# EAGLE schematic NeoPixelClock (EAGLE 8.7.1)
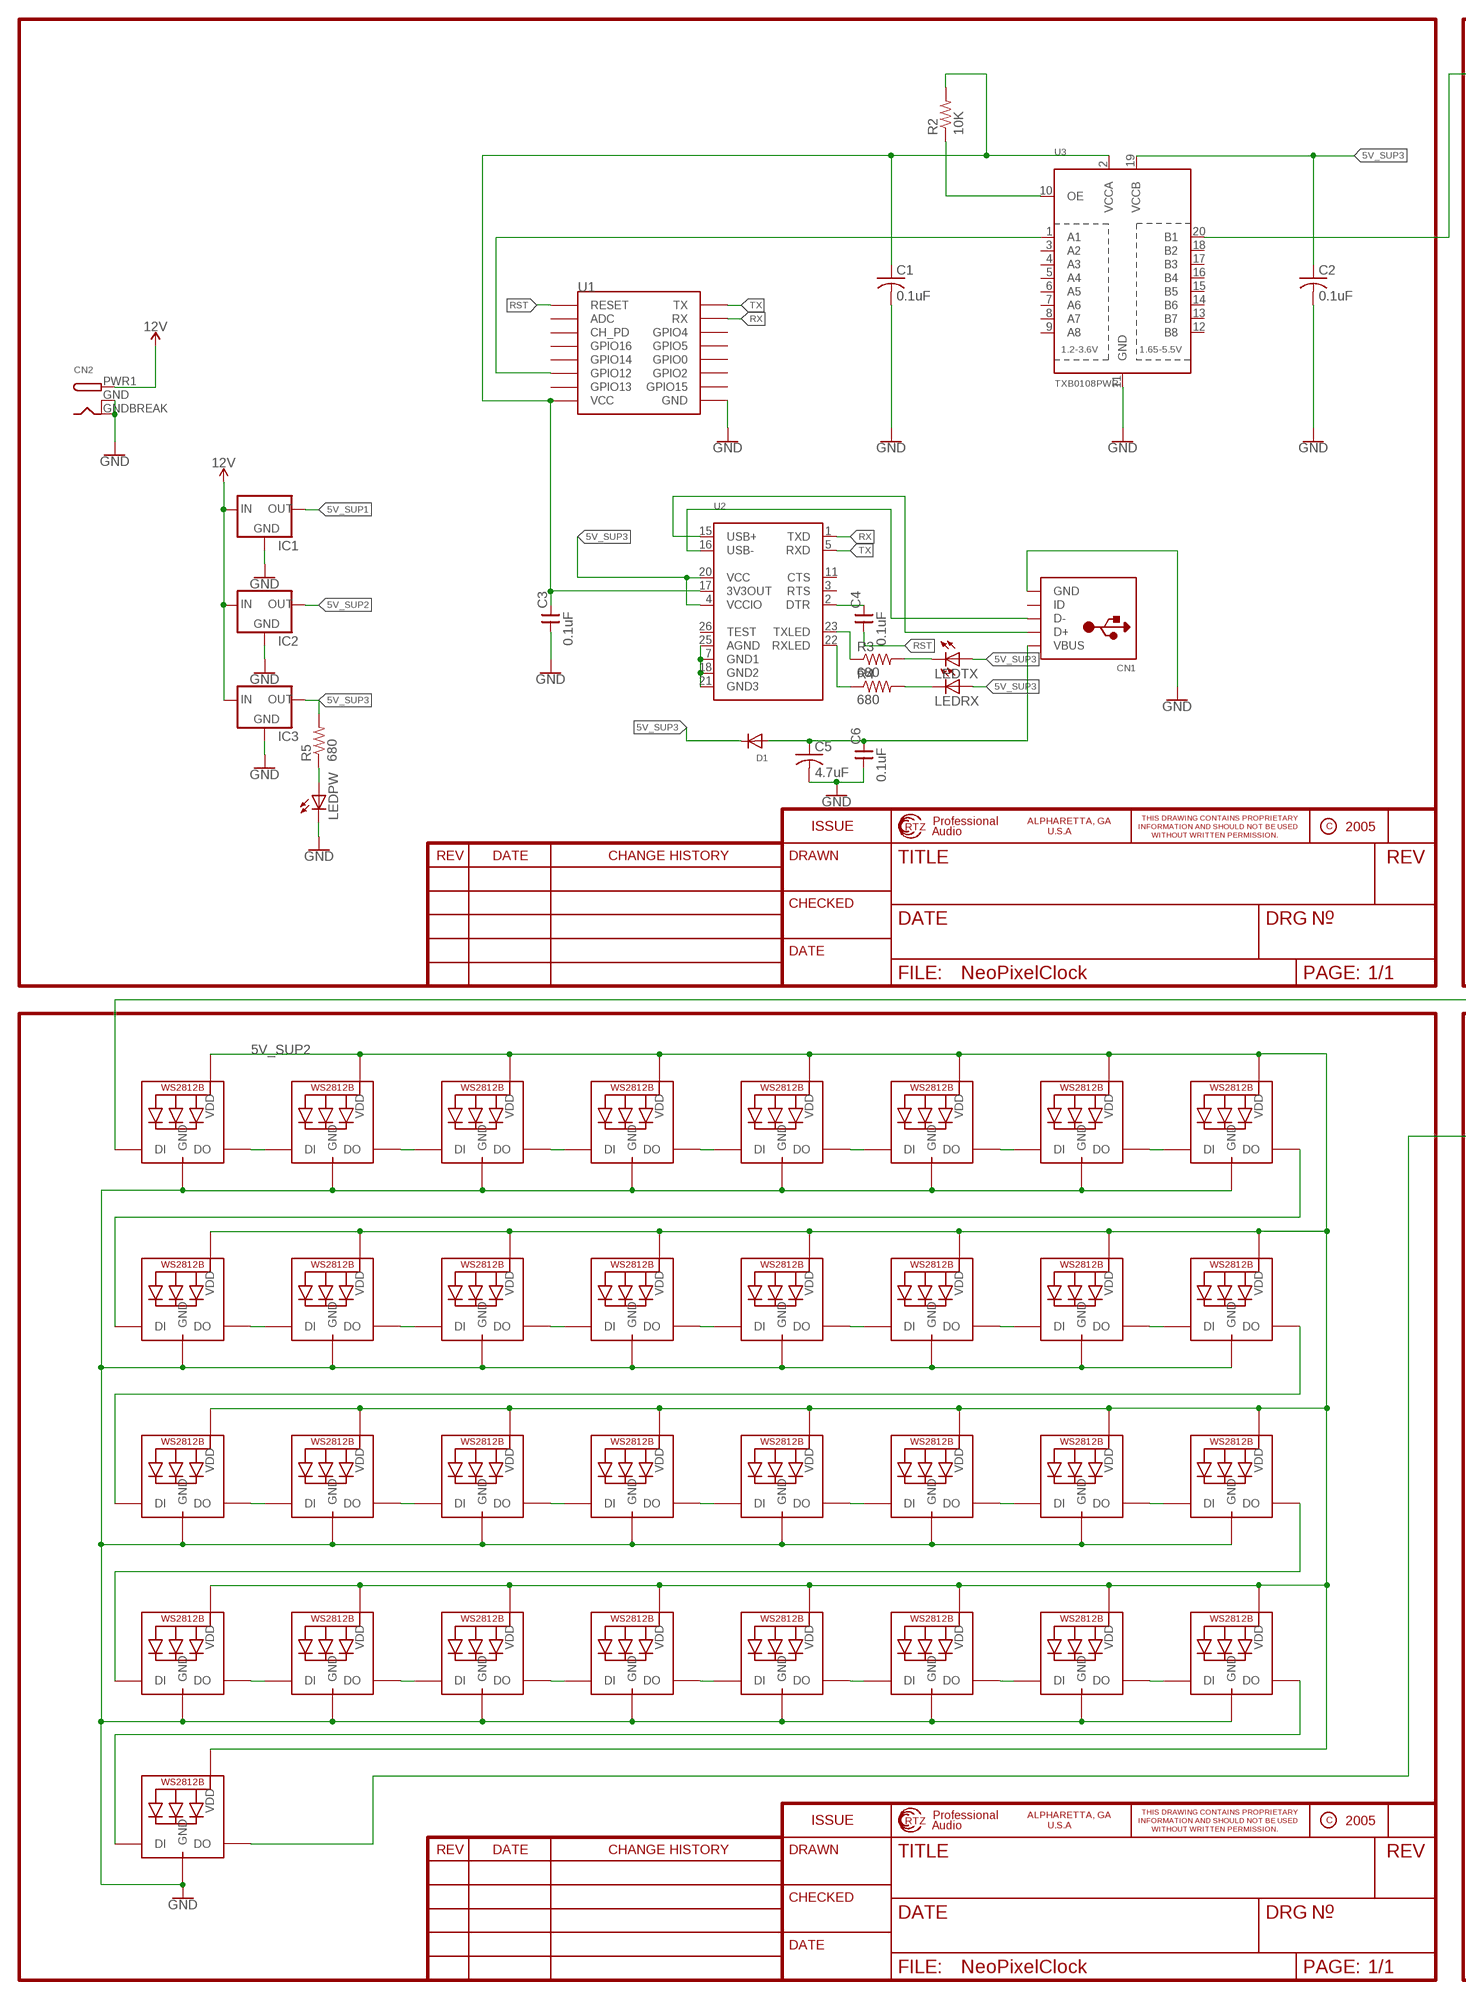
[diagram p0: schematic, sheet 1, part 1 of 2]
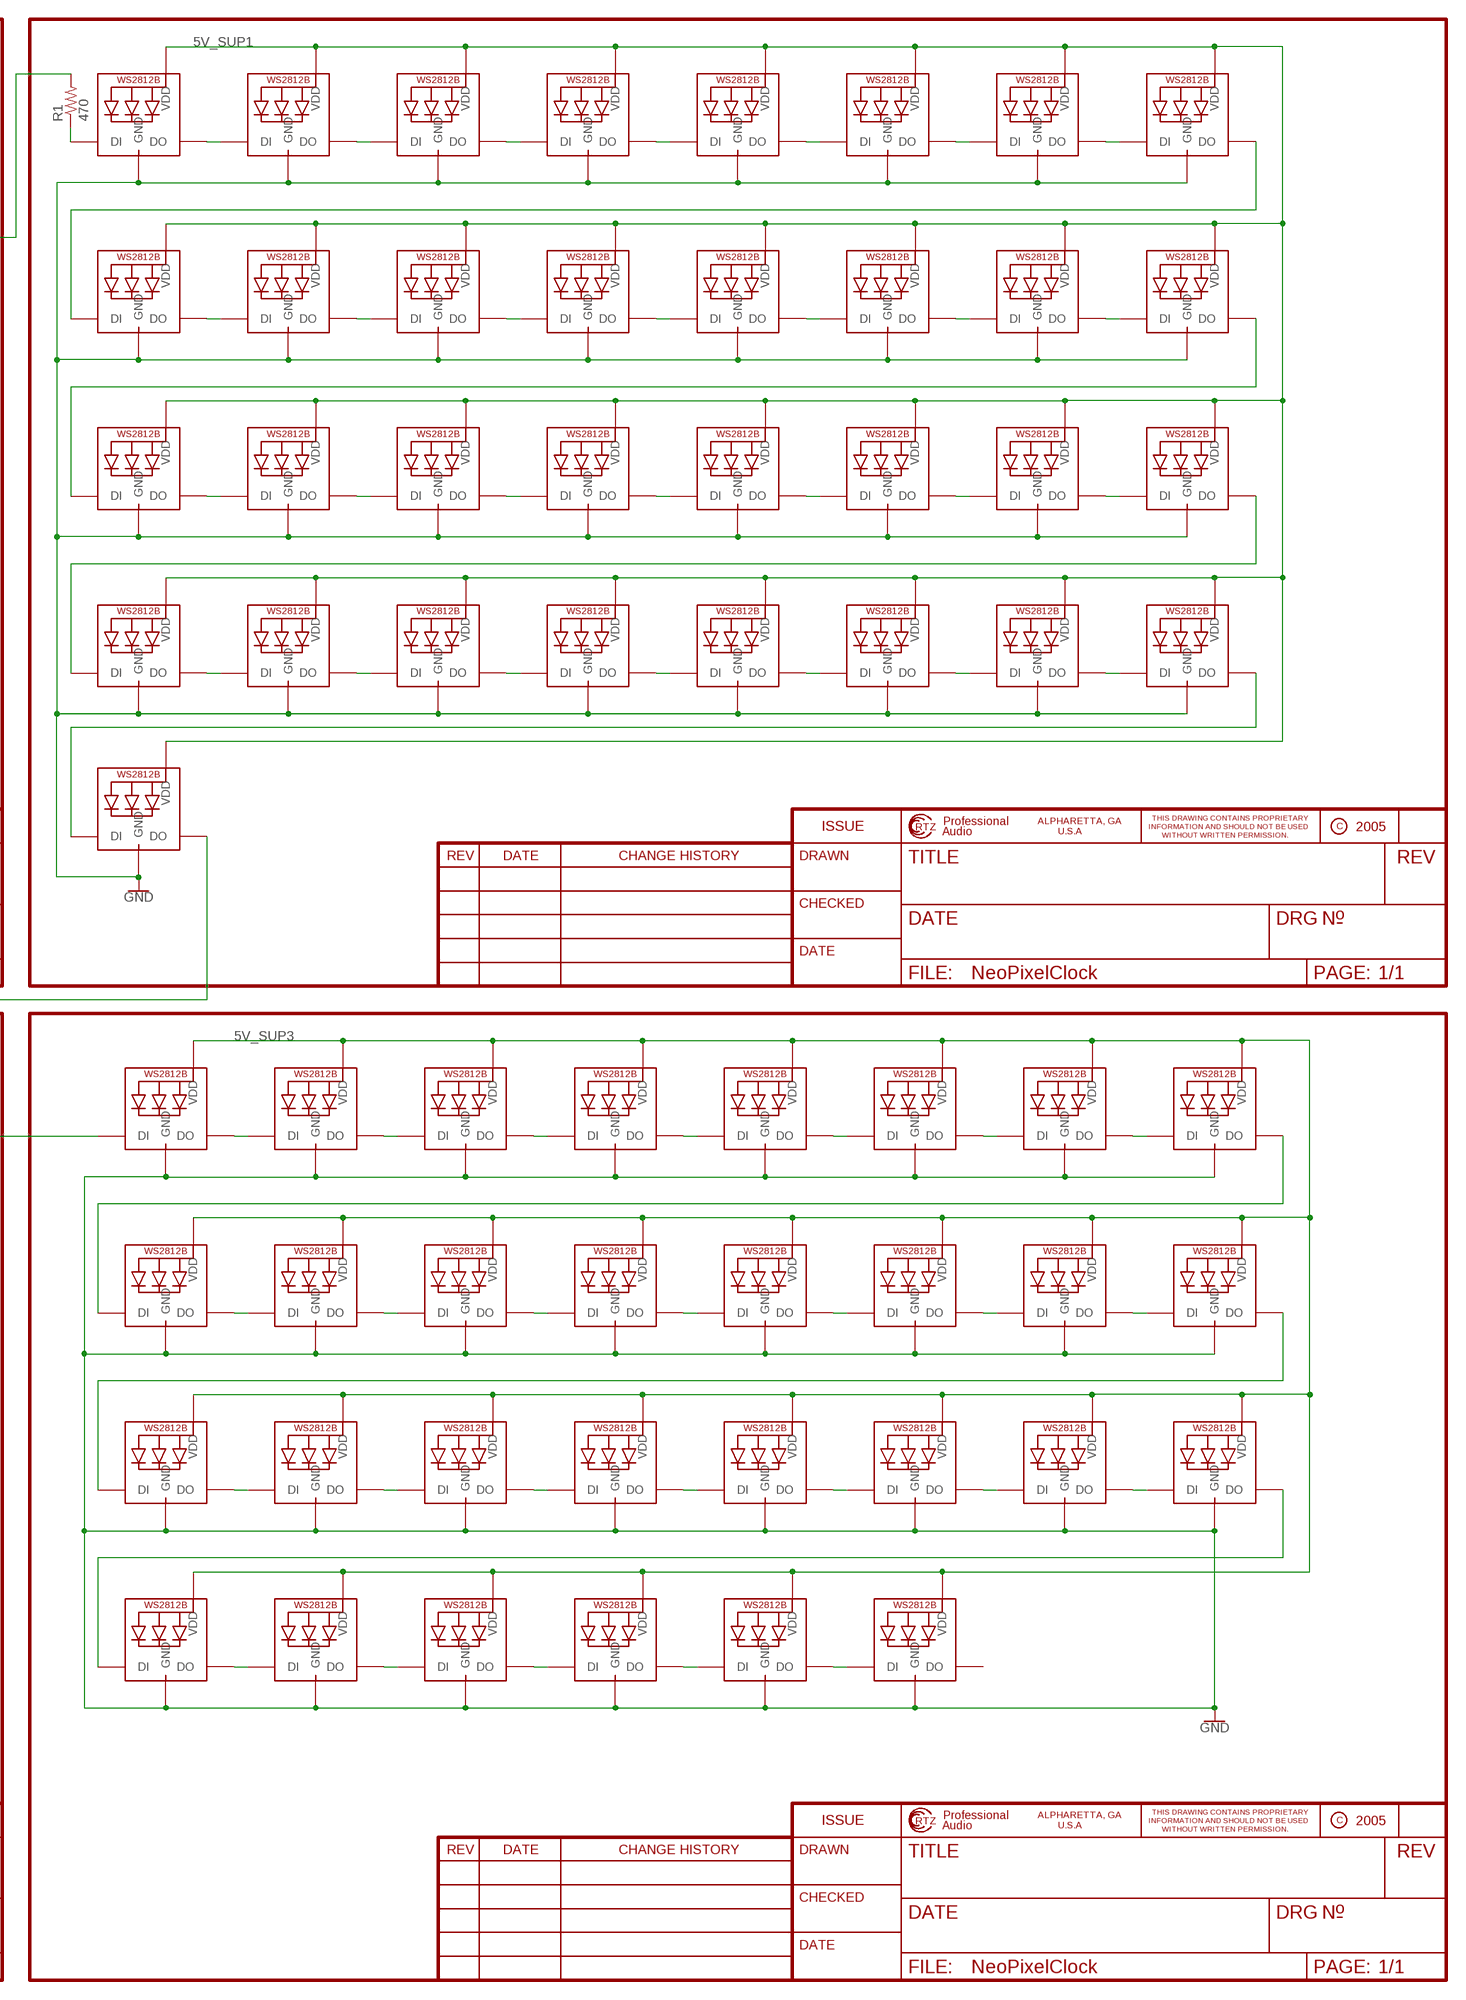
[diagram p1: schematic, sheet 1, part 2 of 2]

## Parts
C1  0.1uF  C-USC0805  [C0805]
C2  0.1uF  C-USC0805  [C0805]
C3  0.1uF  CNP-0805  [0805]
C4  0.1uF  CNP-0805  [0805]
C5  4.7uF  C-USC0805  [C0805]
C6  0.1uF  CNP-0805  [0805]
CN1  USBMINIB  [USB-MINIB]
CN2  DCBARRELSMT  [DCJACK_2MM_SMT]
D1  DIODESOD-123  [SOD-123]
IC1  V_REG_78XXSIDE  [78XXL]
IC2  V_REG_78XXSIDE  [78XXL]
IC3  V_REG_78XXSIDE  [78XXL]
LED1  WS2812B5050  [WS2812B]
LED2  WS2812B5050  [WS2812B]
LED3  WS2812B5050  [WS2812B]
LED4  WS2812B5050  [WS2812B]
LED5  WS2812B5050  [WS2812B]
LED6  WS2812B5050  [WS2812B]
LED7  WS2812B5050  [WS2812B]
LED8  WS2812B5050  [WS2812B]
LED9  WS2812B5050  [WS2812B]
LED10  WS2812B5050  [WS2812B]
LED11  WS2812B5050  [WS2812B]
LED12  WS2812B5050  [WS2812B]
LED13  WS2812B5050  [WS2812B]
LED14  WS2812B5050  [WS2812B]
LED15  WS2812B5050  [WS2812B]
LED16  WS2812B5050  [WS2812B]
LED17  WS2812B5050  [WS2812B]
LED18  WS2812B5050  [WS2812B]
LED19  WS2812B5050  [WS2812B]
LED20  WS2812B5050  [WS2812B]
LED21  WS2812B5050  [WS2812B]
LED22  WS2812B5050  [WS2812B]
LED23  WS2812B5050  [WS2812B]
LED24  WS2812B5050  [WS2812B]
LED25  WS2812B5050  [WS2812B]
LED26  WS2812B5050  [WS2812B]
LED27  WS2812B5050  [WS2812B]
LED28  WS2812B5050  [WS2812B]
LED29  WS2812B5050  [WS2812B]
LED30  WS2812B5050  [WS2812B]
LED31  WS2812B5050  [WS2812B]
LED32  WS2812B5050  [WS2812B]
LED33  WS2812B5050  [WS2812B]
LED34  WS2812B5050  [WS2812B]
LED35  WS2812B5050  [WS2812B]
LED36  WS2812B5050  [WS2812B]
LED37  WS2812B5050  [WS2812B]
LED38  WS2812B5050  [WS2812B]
LED39  WS2812B5050  [WS2812B]
LED40  WS2812B5050  [WS2812B]
LED41  WS2812B5050  [WS2812B]
LED42  WS2812B5050  [WS2812B]
LED43  WS2812B5050  [WS2812B]
LED44  WS2812B5050  [WS2812B]
LED45  WS2812B5050  [WS2812B]
LED46  WS2812B5050  [WS2812B]
LED47  WS2812B5050  [WS2812B]
LED48  WS2812B5050  [WS2812B]
LED49  WS2812B5050  [WS2812B]
LED50  WS2812B5050  [WS2812B]
LED51  WS2812B5050  [WS2812B]
LED52  WS2812B5050  [WS2812B]
LED53  WS2812B5050  [WS2812B]
LED54  WS2812B5050  [WS2812B]
LED55  WS2812B5050  [WS2812B]
LED56  WS2812B5050  [WS2812B]
LED57  WS2812B5050  [WS2812B]
LED58  WS2812B5050  [WS2812B]
LED59  WS2812B5050  [WS2812B]
LED60  WS2812B5050  [WS2812B]
LED61  WS2812B5050  [WS2812B]
LED62  WS2812B5050  [WS2812B]
LED63  WS2812B5050  [WS2812B]
LED64  WS2812B5050  [WS2812B]
LED65  WS2812B5050  [WS2812B]
LED66  WS2812B5050  [WS2812B]
LED67  WS2812B5050  [WS2812B]
LED68  WS2812B5050  [WS2812B]
LED69  WS2812B5050  [WS2812B]
LED70  WS2812B5050  [WS2812B]
LED71  WS2812B5050  [WS2812B]
LED72  WS2812B5050  [WS2812B]
LED73  WS2812B5050  [WS2812B]
LED74  WS2812B5050  [WS2812B]
LED75  WS2812B5050  [WS2812B]
LED76  WS2812B5050  [WS2812B]
LED77  WS2812B5050  [WS2812B]
LED78  WS2812B5050  [WS2812B]
LED79  WS2812B5050  [WS2812B]
LED80  WS2812B5050  [WS2812B]
LED81  WS2812B5050  [WS2812B]
LED82  WS2812B5050  [WS2812B]
LED83  WS2812B5050  [WS2812B]
LED84  WS2812B5050  [WS2812B]
LED85  WS2812B5050  [WS2812B]
LED86  WS2812B5050  [WS2812B]
LED87  WS2812B5050  [WS2812B]
LED88  WS2812B5050  [WS2812B]
LED89  WS2812B5050  [WS2812B]
LED90  WS2812B5050  [WS2812B]
LED91  WS2812B5050  [WS2812B]
LED92  WS2812B5050  [WS2812B]
LED93  WS2812B5050  [WS2812B]
LED94  WS2812B5050  [WS2812B]
LED95  WS2812B5050  [WS2812B]
LED96  WS2812B5050  [WS2812B]
LEDPW  LEDCHIP-LED0805  [CHIP-LED0805]
LEDRX  LEDCHIP-LED0805  [CHIP-LED0805]
LEDTX  LEDCHIP-LED0805  [CHIP-LED0805]
R1  470  R-US_M0805  [M0805]
R2  10K  R-US_R0805  [R0805]
R3  680  R-US_R0805  [R0805]
R4  680  R-US_R0805  [R0805]
R5  680  R-US_R0805  [R0805]
U1  ESP12  [ESP12]
U2  FT232RLSSOP28  [SSOP28DB]
U3  TXB0108PWR  [TSSOP20]

## Nets
3V3: C1.1 C3.2 R2.2 U1.VCC U2.17(3V3OUT) U3.2(VCCA)
5V_SUP1: IC1.OUT LED1.1-VDD(VDD) LED2.1-VDD(VDD) LED3.1-VDD(VDD) LED4.1-VDD(VDD) LED5.1-VDD(VDD) LED6.1-VDD(VDD) LED7.1-VDD(VDD) LED8.1-VDD(VDD) LED9.1-VDD(VDD) LED10.1-VDD(VDD) LED11.1-VDD(VDD) LED12.1-VDD(VDD) LED13.1-VDD(VDD) LED14.1-VDD(VDD) LED15.1-VDD(VDD) LED16.1-VDD(VDD) LED17.1-VDD(VDD) LED18.1-VDD(VDD) LED19.1-VDD(VDD) LED20.1-VDD(VDD) LED21.1-VDD(VDD) LED22.1-VDD(VDD) LED23.1-VDD(VDD) LED24.1-VDD(VDD) LED25.1-VDD(VDD) LED26.1-VDD(VDD) LED27.1-VDD(VDD) LED28.1-VDD(VDD) LED29.1-VDD(VDD) LED30.1-VDD(VDD) LED31.1-VDD(VDD) LED32.1-VDD(VDD) LED33.1-VDD(VDD)
5V_SUP2: IC2.OUT LED34.1-VDD(VDD) LED35.1-VDD(VDD) LED36.1-VDD(VDD) LED37.1-VDD(VDD) LED38.1-VDD(VDD) LED39.1-VDD(VDD) LED40.1-VDD(VDD) LED41.1-VDD(VDD) LED42.1-VDD(VDD) LED43.1-VDD(VDD) LED44.1-VDD(VDD) LED45.1-VDD(VDD) LED46.1-VDD(VDD) LED47.1-VDD(VDD) LED48.1-VDD(VDD) LED49.1-VDD(VDD) LED50.1-VDD(VDD) LED51.1-VDD(VDD) LED52.1-VDD(VDD) LED53.1-VDD(VDD) LED54.1-VDD(VDD) LED55.1-VDD(VDD) LED56.1-VDD(VDD) LED57.1-VDD(VDD) LED58.1-VDD(VDD) LED59.1-VDD(VDD) LED60.1-VDD(VDD) LED61.1-VDD(VDD) LED62.1-VDD(VDD) LED63.1-VDD(VDD) LED64.1-VDD(VDD) LED65.1-VDD(VDD) LED66.1-VDD(VDD)
5V_SUP3: C2.1 D1.C IC3.OUT LED67.1-VDD(VDD) LED68.1-VDD(VDD) LED69.1-VDD(VDD) LED70.1-VDD(VDD) LED71.1-VDD(VDD) LED72.1-VDD(VDD) LED73.1-VDD(VDD) LED74.1-VDD(VDD) LED75.1-VDD(VDD) LED76.1-VDD(VDD) LED77.1-VDD(VDD) LED78.1-VDD(VDD) LED79.1-VDD(VDD) LED80.1-VDD(VDD) LED81.1-VDD(VDD) LED82.1-VDD(VDD) LED83.1-VDD(VDD) LED84.1-VDD(VDD) LED85.1-VDD(VDD) LED86.1-VDD(VDD) LED87.1-VDD(VDD) LED88.1-VDD(VDD) LED89.1-VDD(VDD) LED90.1-VDD(VDD) LED91.1-VDD(VDD) LED92.1-VDD(VDD) LED93.1-VDD(VDD) LED94.1-VDD(VDD) LED95.1-VDD(VDD) LED96.1-VDD(VDD) LEDRX.A LEDTX.A R5.2 U2.4(VCCIO) U2.20(VCC) U3.19(VCCB)
12V: CN2.PWR1(PWR) IC1.IN IC2.IN IC3.IN
GND: C1.2 C2.2 C3.1 C5.2 C6.1 CN1.GND CN2.GND(GNDBREAK) CN2.GNDBREAK(GND) IC1.GND IC2.GND IC3.GND LED1.3-GND(GND) LED2.3-GND(GND) LED3.3-GND(GND) LED4.3-GND(GND) LED5.3-GND(GND) LED6.3-GND(GND) LED7.3-GND(GND) LED8.3-GND(GND) LED9.3-GND(GND) LED10.3-GND(GND) LED11.3-GND(GND) LED12.3-GND(GND) LED13.3-GND(GND) LED14.3-GND(GND) LED15.3-GND(GND) LED16.3-GND(GND) LED17.3-GND(GND) LED18.3-GND(GND) LED19.3-GND(GND) LED20.3-GND(GND) LED21.3-GND(GND) LED22.3-GND(GND) LED23.3-GND(GND) LED24.3-GND(GND) LED25.3-GND(GND) LED26.3-GND(GND) LED27.3-GND(GND) LED28.3-GND(GND) LED29.3-GND(GND) LED30.3-GND(GND) LED31.3-GND(GND) LED32.3-GND(GND) LED33.3-GND(GND) LED34.3-GND(GND) LED35.3-GND(GND) LED36.3-GND(GND) LED37.3-GND(GND) LED38.3-GND(GND) LED39.3-GND(GND) LED40.3-GND(GND) LED41.3-GND(GND) LED42.3-GND(GND) LED43.3-GND(GND) LED44.3-GND(GND) LED45.3-GND(GND) LED46.3-GND(GND) LED47.3-GND(GND) LED48.3-GND(GND) LED49.3-GND(GND) LED50.3-GND(GND) LED51.3-GND(GND) LED52.3-GND(GND) LED53.3-GND(GND) LED54.3-GND(GND) LED55.3-GND(GND) LED56.3-GND(GND) LED57.3-GND(GND) LED58.3-GND(GND) LED59.3-GND(GND) LED60.3-GND(GND) LED61.3-GND(GND) LED62.3-GND(GND) LED63.3-GND(GND) LED64.3-GND(GND) LED65.3-GND(GND) LED66.3-GND(GND) LED67.3-GND(GND) LED68.3-GND(GND) LED69.3-GND(GND) LED70.3-GND(GND) LED71.3-GND(GND) LED72.3-GND(GND) LED73.3-GND(GND) LED74.3-GND(GND) LED75.3-GND(GND) LED76.3-GND(GND) LED77.3-GND(GND) LED78.3-GND(GND) LED79.3-GND(GND) LED80.3-GND(GND) LED81.3-GND(GND) LED82.3-GND(GND) LED83.3-GND(GND) LED84.3-GND(GND) LED85.3-GND(GND) LED86.3-GND(GND) LED87.3-GND(GND) LED88.3-GND(GND) LED89.3-GND(GND) LED90.3-GND(GND) LED91.3-GND(GND) LED92.3-GND(GND) LED93.3-GND(GND) LED94.3-GND(GND) LED95.3-GND(GND) LED96.3-GND(GND) LEDPW.C U1.GND U3.11(GND)
N$1: U1.GPIO12 U3.1(A1)
N$2: LED34.2-DOUT(DO) LED35.4-DIN(DI)
N$3: LED35.2-DOUT(DO) LED36.4-DIN(DI)
N$4: R1.2 U3.20(B1)
N$5: LED1.2-DOUT(DO) LED2.4-DIN(DI)
N$6: LED2.2-DOUT(DO) LED3.4-DIN(DI)
N$7: LED3.2-DOUT(DO) LED4.4-DIN(DI)
N$8: LED4.2-DOUT(DO) LED5.4-DIN(DI)
N$9: LED5.2-DOUT(DO) LED6.4-DIN(DI)
N$10: LED6.2-DOUT(DO) LED7.4-DIN(DI)
N$11: LED7.2-DOUT(DO) LED8.4-DIN(DI)
N$12: U2.7(GND1) U2.18(GND2) U2.21(GND3) U2.25(AGND)
N$13: LED8.2-DOUT(DO) LED9.4-DIN(DI)
N$14: LED9.2-DOUT(DO) LED10.4-DIN(DI)
N$15: LED10.2-DOUT(DO) LED11.4-DIN(DI)
N$16: LED11.2-DOUT(DO) LED12.4-DIN(DI)
N$17: LED12.2-DOUT(DO) LED13.4-DIN(DI)
N$18: LED13.2-DOUT(DO) LED14.4-DIN(DI)
N$19: LED14.2-DOUT(DO) LED15.4-DIN(DI)
N$20: LED15.2-DOUT(DO) LED16.4-DIN(DI)
N$22: LED16.2-DOUT(DO) LED17.4-DIN(DI)
N$23: LED17.2-DOUT(DO) LED18.4-DIN(DI)
N$24: LED18.2-DOUT(DO) LED19.4-DIN(DI)
N$25: LED19.2-DOUT(DO) LED20.4-DIN(DI)
N$26: LED20.2-DOUT(DO) LED21.4-DIN(DI)
N$27: LED21.2-DOUT(DO) LED22.4-DIN(DI)
N$28: LED22.2-DOUT(DO) LED23.4-DIN(DI)
N$29: LED23.2-DOUT(DO) LED24.4-DIN(DI)
N$31: LED24.2-DOUT(DO) LED25.4-DIN(DI)
N$32: LED25.2-DOUT(DO) LED26.4-DIN(DI)
N$33: LED26.2-DOUT(DO) LED27.4-DIN(DI)
N$34: LED27.2-DOUT(DO) LED28.4-DIN(DI)
N$35: LED28.2-DOUT(DO) LED29.4-DIN(DI)
N$36: LED29.2-DOUT(DO) LED30.4-DIN(DI)
N$37: LED30.2-DOUT(DO) LED31.4-DIN(DI)
N$38: LED31.2-DOUT(DO) LED32.4-DIN(DI)
N$40: LED32.2-DOUT(DO) LED33.4-DIN(DI)
N$41: LED36.2-DOUT(DO) LED37.4-DIN(DI)
N$42: LED37.2-DOUT(DO) LED38.4-DIN(DI)
N$43: LED38.2-DOUT(DO) LED39.4-DIN(DI)
N$44: LED39.2-DOUT(DO) LED40.4-DIN(DI)
N$45: LED40.2-DOUT(DO) LED41.4-DIN(DI)
N$46: C5.1 C6.2 CN1.VBUS D1.A
N$47: LED41.2-DOUT(DO) LED42.4-DIN(DI)
N$48: LED42.2-DOUT(DO) LED43.4-DIN(DI)
N$49: LED43.2-DOUT(DO) LED44.4-DIN(DI)
N$50: LED44.2-DOUT(DO) LED45.4-DIN(DI)
N$51: LED45.2-DOUT(DO) LED46.4-DIN(DI)
N$52: LED46.2-DOUT(DO) LED47.4-DIN(DI)
N$53: LED47.2-DOUT(DO) LED48.4-DIN(DI)
N$54: LED48.2-DOUT(DO) LED49.4-DIN(DI)
N$56: LED49.2-DOUT(DO) LED50.4-DIN(DI)
N$57: LED50.2-DOUT(DO) LED51.4-DIN(DI)
N$58: LED51.2-DOUT(DO) LED52.4-DIN(DI)
N$59: LED52.2-DOUT(DO) LED53.4-DIN(DI)
N$60: LED53.2-DOUT(DO) LED54.4-DIN(DI)
N$61: LED54.2-DOUT(DO) LED55.4-DIN(DI)
N$62: LED55.2-DOUT(DO) LED56.4-DIN(DI)
N$63: LED56.2-DOUT(DO) LED57.4-DIN(DI)
N$65: LED57.2-DOUT(DO) LED58.4-DIN(DI)
N$66: LED58.2-DOUT(DO) LED59.4-DIN(DI)
N$67: LED59.2-DOUT(DO) LED60.4-DIN(DI)
N$68: LED60.2-DOUT(DO) LED61.4-DIN(DI)
N$69: LED61.2-DOUT(DO) LED62.4-DIN(DI)
N$70: LED62.2-DOUT(DO) LED63.4-DIN(DI)
N$71: LED63.2-DOUT(DO) LED64.4-DIN(DI)
N$72: LED64.2-DOUT(DO) LED65.4-DIN(DI)
N$74: LED65.2-DOUT(DO) LED66.4-DIN(DI)
N$75: CN1.D- U2.16(USB-)
N$76: LED67.2-DOUT(DO) LED68.4-DIN(DI)
N$77: LED68.2-DOUT(DO) LED69.4-DIN(DI)
N$78: LED69.2-DOUT(DO) LED70.4-DIN(DI)
N$79: LED70.2-DOUT(DO) LED71.4-DIN(DI)
N$80: LED71.2-DOUT(DO) LED72.4-DIN(DI)
N$81: LED72.2-DOUT(DO) LED73.4-DIN(DI)
N$82: LED73.2-DOUT(DO) LED74.4-DIN(DI)
N$83: CN1.D+ U2.15(USB+)
N$84: LED74.2-DOUT(DO) LED75.4-DIN(DI)
N$85: LED75.2-DOUT(DO) LED76.4-DIN(DI)
N$86: LED76.2-DOUT(DO) LED77.4-DIN(DI)
N$87: LED77.2-DOUT(DO) LED78.4-DIN(DI)
N$88: LED78.2-DOUT(DO) LED79.4-DIN(DI)
N$89: LED79.2-DOUT(DO) LED80.4-DIN(DI)
N$90: LED80.2-DOUT(DO) LED81.4-DIN(DI)
N$91: LED81.2-DOUT(DO) LED82.4-DIN(DI)
N$93: LED82.2-DOUT(DO) LED83.4-DIN(DI)
N$94: LED83.2-DOUT(DO) LED84.4-DIN(DI)
N$95: LED84.2-DOUT(DO) LED85.4-DIN(DI)
N$96: LED85.2-DOUT(DO) LED86.4-DIN(DI)
N$97: LED86.2-DOUT(DO) LED87.4-DIN(DI)
N$98: LED87.2-DOUT(DO) LED88.4-DIN(DI)
N$99: LED88.2-DOUT(DO) LED89.4-DIN(DI)
N$100: LED89.2-DOUT(DO) LED90.4-DIN(DI)
N$102: LED90.2-DOUT(DO) LED91.4-DIN(DI)
N$103: LED91.2-DOUT(DO) LED92.4-DIN(DI)
N$104: LED92.2-DOUT(DO) LED93.4-DIN(DI)
N$105: LED93.2-DOUT(DO) LED94.4-DIN(DI)
N$106: LED94.2-DOUT(DO) LED95.4-DIN(DI)
N$107: LED95.2-DOUT(DO) LED96.4-DIN(DI)
N$112: LED1.4-DIN(DI) R1.1
N$113: LED33.2-DOUT(DO) LED34.4-DIN(DI)
N$114: LED66.2-DOUT(DO) LED67.4-DIN(DI)
N$115: LEDTX.C R3.2
N$116: C4.2 U2.2(DTR)
N$117: R3.1 U2.23(TXLED)
N$118: R4.1 U2.22(RXLED)
N$119: LEDRX.C R4.2
N$120: LEDPW.A R5.1
N$127: R2.1 U3.10(OE)
RST: C4.1 U1.RESET
RX: U1.RX U2.1(TXD)
TX: U1.TX U2.5(RXD)
Unconnected: CN1.ID LED96.2-DOUT(DO) U1.ADC U1.CH_PD U1.GPIO0 U1.GPIO2 U1.GPIO4 U1.GPIO5 U1.GPIO13 U1.GPIO14 U1.GPIO15 U1.GPIO16 U2.3(RTS) U2.11(CTS) U2.26(TEST) U3.3(A2) U3.4(A3) U3.5(A4) U3.6(A5) U3.7(A6) U3.8(A7) U3.9(A8) U3.12(B8) U3.13(B7) U3.14(B6) U3.15(B5) U3.16(B4) U3.17(B3) U3.18(B2)

## Library data of the parts
C1 C2 C5 = adafruit:C-US: CAPACITOR, American symbol
C3 C4 C6 = cap-master:CNP-: NON-POLARIZED CAP
CN1 = adafruit:USB: USB Connectors USBMINIB - Surface Mount Female Mini-B USB Connector 4UConnector: 06564 By microbuilder.eu Thru-hole RA Female Mini-B USB Connector 4UConnector: 18732 By ladyada.net
CN2 = adafruit:DCBARREL: 2.0mm DC Barrel Jack DCJACK_2MM_PTH - Through Hole Jack (4UConnector: 05537)
D1 = adafruit:DIODE: Diode SMADIODE - SMA Surface Mount Package 20V 1A Schottky Diode Digikey: 641-1014-6-ND DO-1N4148 - Through Hole Small Current Diode SOD-123 20V 1 A (.5mV Vf) Schottky Diode - Digikey: MBRX120TPMSCT-ND SOD-323 10V 570mA (.38mV Vf, 3ns) Schottky Diode - Digikey: ZLLS410CT-ND SOD-523 30V 30mA Schottky Diode (RB751S-40TE61) - Digikey: RB751S-40TE61CT-ND SOT23-R/W - SOT23 Package (R = Solder Paste/Reflow Ovens, W = Hand-Soldering) BAT54Film 40V 300mA - Digikey: 497-7162-1-ND
IC1-IC3 = SparkFun:V_REG_78XX: Voltage Regulator Standard 7805 5V regulator. IGO (Input Ground Output). Spark Fun Electronics SKU : COM-00107
LED1-LED96 = adafruit:WS2812B
LEDPW LEDRX LEDTX = adafruit:LED: LED OSRAM: - CHIPLED LG R971, LG N971, LY N971, LG Q971, LY Q971, LO R971, LY R971 LH N974, LH R974 LS Q976, LO Q976, LY Q976 LO Q996 - Hyper CHIPLED LW Q18S LB Q993, LB Q99A, LB R99A - SideLED LS A670, LO A670, LY A670, LG A670, LP A670 LB A673, LV A673, LT A673, LW A673 LH A674 LY A675 LS A676, LA A676, LO A676, LY A676, LW A676 LS A679, LY A679, LG A679 - Hyper Micro SIDELED® LS Y876, LA Y876, LO Y876, LY Y876 LT Y87S - SmartLED LW L88C, LW L88S LB L89C, LB L89S, LG L890 LS L89K, LO L89K, LY L89K LS L896, LA L896, LO L896, LY L896 - TOPLED LS T670, LO T670, LY T670, LG T670, LP T670 LSG T670, LSP T670, LSY T670, LOP T670, LYG T670 LG T671, LOG T671, LSG T671 LB T673, LV T673, LT T673, LW T673 LH T674 LS T676, LA T676, LO T676, LY T676, LB T676, LH T676, LSB T676, LW T676 LB T67C, LV T67C, LT T67C, LS T67K, LO T67K, LY T67K, LW E67C LS E67B, LA E67B, LO E67B, LY E67B, LB E67C, LV E67C, LT E67C LW T67C LS T679, LY T679, LG T679 LS T770, LO T770, LY T770, LG T770, LP T770 LB T773, LV T773, LT T773, LW T773 LH T774 LS E675, LA E675, LY E675, LS T675 LS T776, LA T776, LO T776, LY T776, LB T776 LHGB T686 LT T68C, LB T68C - Hyper Mini TOPLED® LB M676 - Mini TOPLED Santana® LG M470 LS M47K, LO M47K, LY M47K Source: http://www.osram.convergy.de/
R1-R5 = adafruit:R-US_: RESISTOR, American symbol
U1 = esp8266modules:ESP12: ESP8266 Wifi module 12
U2 = microbuilder:FT232RL: FTDI FT232RL USB TO RS232 Converter Digikey: 768-1007-1-ND
U3 = microbuilder:TXB0108PWR: 8-Bit Bi-Directional Level Shifter 1.2V-3.6V (VCCA) to 1.65V-5.5V (VCCB) bi-directional level shifter with auto direction sensing. Max data rate - VCCA 1.8V: 20Mbps (50ns), VCCA 3.3V: 100Mbps (10ns) Digikey: 296-21527-1-ND